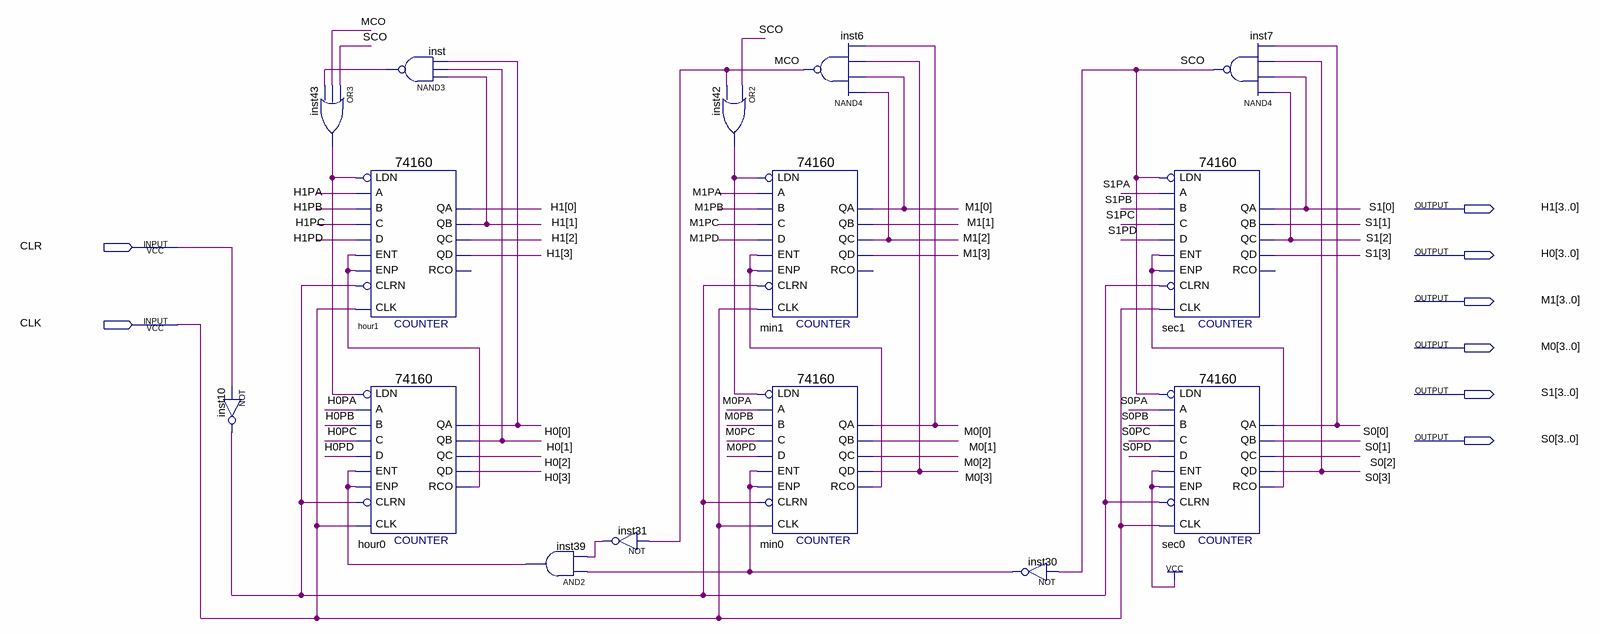
[diagram p0: schematic sheet]
// Quartus schematic clock_.bdf as structural Verilog: 15 symbols, 8 pins
module clock_ (
  input  CLR,
  input  CLK,
  output [3:0] H1,
  output [3:0] H0,
  output [3:0] M1,
  output [3:0] M0,
  output [3:0] S1,
  output [3:0] S0
);

  wire H0PA, H0PB, H0PC, H0PD, H1PA, H1PB, H1PC, H1PD, hour0_rco, inst10_out, inst30_out, inst31_out,
       inst39_out, inst42_out, inst43_out, inst_out, M0PA, M0PB, M0PC, M0PD, M1PA, M1PB, M1PC, M1PD, MCO,
       min0_rco, S0PA, S0PB, S0PC, S0PD, S1PA, S1PB, S1PC, S1PD, SCO, sec0_rco;

  not inst10 (inst10_out, CLR);
  or inst43 (inst43_out, SCO, MCO, inst_out);
  \74160  hour1 (
    .CLK(CLK), .ENT(hour0_rco), .A(H1PA), .B(H1PB), .C(H1PC), .D(H1PD), .LDN(inst43_out), .ENP(hour0_rco),
    .CLRN(inst10_out), .QD(H1[3]), .QA(H1[0]), .QB(H1[1]), .QC(H1[2]));  // open: RCO
  \74160  hour0 (
    .CLK(CLK), .ENT(inst39_out), .A(H0PA), .B(H0PB), .C(H0PC), .D(H0PD), .LDN(inst43_out), .ENP(inst39_out),
    .CLRN(inst10_out), .QD(H0[3]), .QA(H0[0]), .QB(H0[1]), .QC(H0[2]), .RCO(hour0_rco));
  nand inst (inst_out, H1[1], H0[1], H0[0]);
  and inst39 (inst39_out, inst30_out, inst31_out);
  not inst31 (inst31_out, MCO);
  or inst42 (inst42_out, SCO, MCO);
  \74160  min1 (
    .CLK(CLK), .ENT(min0_rco), .A(M1PA), .B(M1PB), .C(M1PC), .D(M1PD), .LDN(inst42_out), .ENP(min0_rco),
    .CLRN(inst10_out), .QD(M1[3]), .QA(M1[0]), .QB(M1[1]), .QC(M1[2]));  // open: RCO
  \74160  min0 (
    .CLK(CLK), .ENT(inst30_out), .A(M0PA), .B(M0PB), .C(M0PC), .D(M0PD), .LDN(inst42_out), .ENP(inst30_out),
    .CLRN(inst10_out), .QD(M0[3]), .QA(M0[0]), .QB(M0[1]), .QC(M0[2]), .RCO(min0_rco));
  nand inst6 (MCO, M1[2], M1[0], M0[3], M0[0]);
  not inst30 (inst30_out, SCO);
  \74160  sec1 (
    .CLK(CLK), .ENT(sec0_rco), .A(S1PA), .B(S1PB), .C(S1PC), .D(S1PD), .LDN(SCO), .ENP(sec0_rco),
    .CLRN(inst10_out), .QD(S1[3]), .QA(S1[0]), .QB(S1[1]), .QC(S1[2]));  // open: RCO
  \74160  sec0 (
    .CLK(CLK), .ENT(1'b1), .A(S0PA), .B(S0PB), .C(S0PC), .D(S0PD), .LDN(SCO), .ENP(1'b1), .CLRN(inst10_out),
    .QD(S0[3]), .QA(S0[0]), .QB(S0[1]), .QC(S0[2]), .RCO(sec0_rco));
  nand inst7 (SCO, S1[2], S1[0], S0[3], S0[0]);
endmodule
